# Altium schematic sheet 01_Measure.SchDoc
size A4
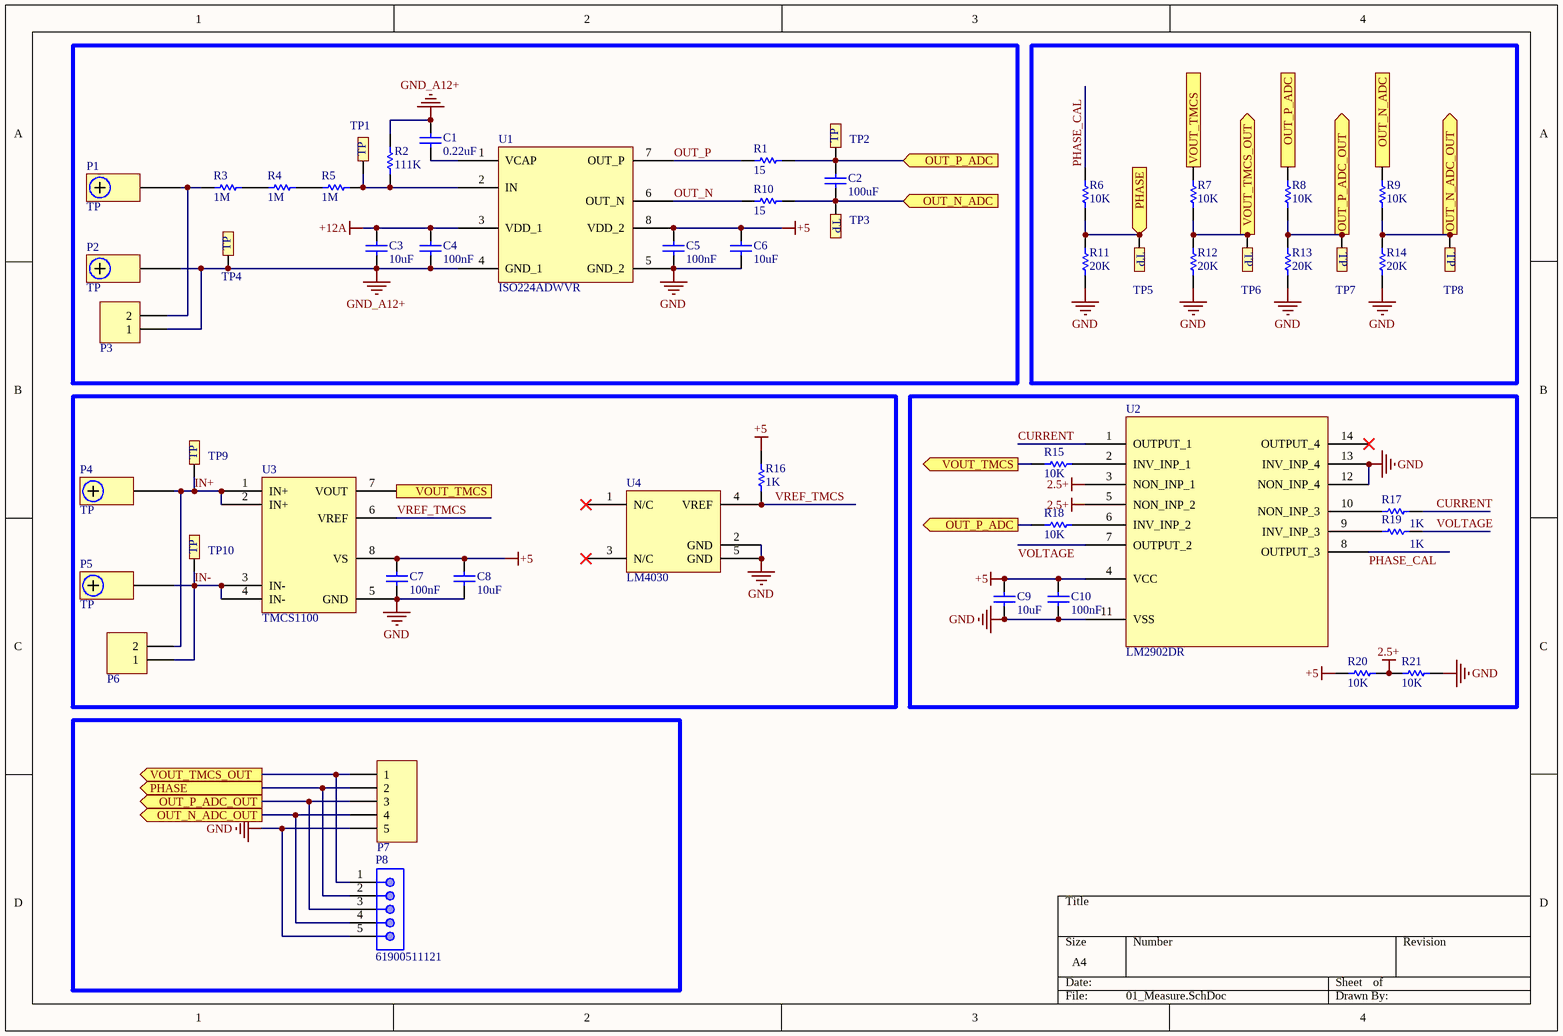
[diagram p0: 01_Measure.SchDoc]

## Parts
C1  value 0.22uF  [CAP-SM-0805]  (hidden comment: Cap Non-Pol SMD)
C2  value 100uF  [CAP-SM-1210]  (hidden comment: Cap Non-Pol SMD)
C3  value 10uF  [CAP-SM-0805]  (hidden comment: Cap Non-Pol SMD)
C4  value 100nF  [CAP-SM-0805]  (hidden comment: Cap Non-Pol SMD)
C5  value 100nF  [CAP-SM-0805]  (hidden comment: Cap Non-Pol SMD)
C6  value 10uF  [CAP-SM-0805]  (hidden comment: Cap Non-Pol SMD)
C7  value 100nF  [CAP-SM-0805]  (hidden comment: Cap Non-Pol SMD)
C8  value 10uF  [CAP-SM-0805]  (hidden comment: Cap Non-Pol SMD)
C9  value 10uF  [CAP-SM-0603]  (hidden comment: Cap Non-Pol SMD)
C10  value 100nF  [CAP-SM-0603]  (hidden comment: Cap Non-Pol SMD)
P1  TP  [TP]
P2  TP  [TP]
P3  Domino 2  [DOMINO 2- 5mm]  (value not drawn)
P4  TP  [TP]
P5  TP  [TP]
P6  Domino 2  [DOMINO 2- 5mm]  (value not drawn)
P7  Header 5  [JP5]  (value not drawn)
P8  61900511121  [61900511121]
R1  value 15  [RES-SM-1206]  (hidden comment: RESISTOR SMD)
R2  value 111K  [RES-SM-1206]  (hidden comment: RESISTOR SMD)
R3  value 1M  [RES-SM-1206]  (hidden comment: RESISTOR SMD)
R4  value 1M  [RES-SM-1206]  (hidden comment: RESISTOR SMD)
R5  value 1M  [RES-SM-1206]  (hidden comment: RESISTOR SMD)
R6  value 10K  [RES-SM-0603]  (hidden comment: RESISTOR SMD)
R7  value 10K  [RES-SM-0603]  (hidden comment: RESISTOR SMD)
R8  value 10K  [RES-SM-0603]  (hidden comment: RESISTOR SMD)
R9  value 10K  [RES-SM-0603]  (hidden comment: RESISTOR SMD)
R10  value 15  [RES-SM-1206]  (hidden comment: RESISTOR SMD)
R11  value 20K  [RES-SM-0603]  (hidden comment: RESISTOR SMD)
R12  value 20K  [RES-SM-0603]  (hidden comment: RESISTOR SMD)
R13  value 20K  [RES-SM-0603]  (hidden comment: RESISTOR SMD)
R14  value 20K  [RES-SM-0603]  (hidden comment: RESISTOR SMD)
R15  value 10K  [RES-SM-0603]  (hidden comment: RESISTOR SMD)
R16  value 1K  [RES-SM-0603]  (hidden comment: RESISTOR SMD)
R17  value 1K  [RES-SM-0603]  (hidden comment: RESISTOR SMD)
R18  value 10K  [RES-SM-0603]  (hidden comment: RESISTOR SMD)
R19  value 1K  [RES-SM-0603]  (hidden comment: RESISTOR SMD)
R20  value 10K  [RES-SM-0603]  (hidden comment: RESISTOR SMD)
R21  value 10K  [RES-SM-0603]  (hidden comment: RESISTOR SMD)
TP1  Test Point  [TP]  (value not drawn)
TP2  Test Point  [TP]  (value not drawn)
TP3  Test Point  [TP]  (value not drawn)
TP4  Test Point  [TP]  (value not drawn)
TP5  Test Point  [TP]  (value not drawn)
TP6  Test Point  [TP]  (value not drawn)
TP7  Test Point  [TP]  (value not drawn)
TP8  Test Point  [TP]  (value not drawn)
TP9  Test Point  [TP]  (value not drawn)
TP10  Test Point  [TP]  (value not drawn)
U1  ISO224ADWVR  [SOIC127P1150X280-8N]
U2  LM2902DR  [SOIC127P600X175-14N]
U3  TMCS1100  [SOIC127P650X175-8N]
U4  LM4030  [SOT95P279X130-5N]

## Ports
OUT_N_ADC (in), OUT_N_ADC (out), OUT_N_ADC_OUT (out), OUT_P_ADC (in), OUT_P_ADC (out), OUT_P_ADC_OUT (out), PHASE (in), PHASE (out), VOUT_TMCS (in), VOUT_TMCS (out), VOUT_TMCS_OUT (out)

## Nets
2.5+: R20.1 R21.2 U2.3(NON_INP_1) U2.5(NON_INP_2)
+5: C5.2 C6.2 C7.2 C8.2 C9.2 C10.1 R16.2 R20.2 U1.8(VDD_2) U2.4(VCC) U3.8(VS)
+12A: C3.2 C4.2 U1.3(VDD_1)
GND: C5.1 C6.1 C7.1 C8.1 C9.1 C10.2 P7.5 P8.5 R11.1 R12.1 R13.1 R14.1 R21.1 U1.5(GND_2) U2.11(VSS) U2.12(NON_INP_4) U2.13(INV_INP_4) U3.5(GND) U4.2(GND) U4.5(GND)
GND_A12+: C1.2 C3.1 C4.1 P2.1 P3.1 R2.2 TP4.TP1 U1.4(GND_1)
CURRENT: R17.1 U2.1(OUTPUT_1)
IN+: P4.1 P6.2 TP9.TP1 U3.1(IN+) U3.2(IN+)
IN-: P5.1 P6.1 TP10.TP1 U3.3(IN-) U3.4(IN-)
OUT_N: R10.1 U1.6(OUT_N)
OUT_N_ADC: C2.1 R9.2 R10.2 TP3.TP1 ; port OUT_N_ADC
OUT_N_ADC_OUT: P7.4 P8.4 R9.1 R14.2 TP8.TP1 ; port OUT_N_ADC_OUT
OUT_P: R1.1 U1.7(OUT_P)
OUT_P_ADC: C2.2 R1.2 R8.2 R18.2 TP2.TP1 ; port OUT_P_ADC
OUT_P_ADC_OUT: P7.3 P8.3 R8.1 R13.2 TP7.TP1 ; port OUT_P_ADC_OUT
PHASE: P7.2 P8.2 R6.1 R11.2 TP5.TP1 ; port PHASE
PHASE_CAL: R6.2 U2.8(OUTPUT_3)
VOLTAGE: R19.1 U2.7(OUTPUT_2)
VOUT_TMCS: R7.2 R15.1 U3.7(VOUT) ; port VOUT_TMCS
VOUT_TMCS_OUT: P7.1 P8.1 R7.1 R12.2 TP6.TP1 ; port VOUT_TMCS_OUT
VREF_TMCS: R16.1 U3.6(VREF) U4.4(VREF)
NetC1_1: C1.1 U1.1(VCAP)
NetP1_1: P1.1 P3.2 R3.1
NetR2_1: R2.1 R5.2 TP1.TP1 U1.2(IN)
NetR3_2: R3.2 R4.1
NetR4_2: R4.2 R5.1
NetR15_2: R15.2 U2.2(INV_INP_1)
NetR17_2: R17.2 U2.10(NON_INP_3)
NetR18_1: R18.1 U2.6(INV_INP_2)
NetR19_2: R19.2 U2.9(INV_INP_3)

Not connected (* = marked no-connect by the designer): U2 14(OUTPUT_4)*; U4 1(N/C)* 3(N/C)*

## Notes on the sheet
- (in symbol Test Point) TP

## Library data of the parts
C1-C10 = Cap Non-Pol SMD: Capacitor
P3 P6 = Domino 2: Domino, 2-Pin; LatestRevisionDate: 17-Jul-2002; LatestRevisionNote: Re-released for DXP Platform.; Publisher: Altium Limited
P7 = Header 5: Header, 5-Pin; LatestRevisionDate: 17-Jul-2002; LatestRevisionNote: Re-released for DXP Platform.; Publisher: Altium Limited
P8 = 61900511121: WR-WTB THT Male Vertical Locking Header, pitch 2.54mm, 5p; Pin Number: 5; Contact Resistance: 20mOhm; Rated Current: 3A; Withstanding Voltage: 1000VAC; Working Voltage: 250VAC; ComponentLink1Description: Manufacturer; ComponentLink1URL: http://www.we-online.de; ComponentLink2Description: Datasheet; ComponentLink2URL: https://www.we-online.com/catalog/datasheet/61900511121.pdf; Pitch: 2.54mm; Published Date: January 2020; Publisher: Wurth Elektronik; Mounting Technology: THT; Packaging: Bag; Operating Temperature: -40 to +105degC; Part Number: 61900511121; Gender: Male; Type: Vertical
R1-R21 = RESISTOR SMD: Resistor
U1 = ISO224ADWVR: Manufacturer: Texas Instruments; ComponentLink1Description: Supplier 1 Link; Supplier 1: Mouser; ComponentLink1URL: https://www.mouser.vn/ProductDetail/Texas-Instruments/ISO224ADWV?qs=%252BEew9%252B0nqrAIOtaYYgHDyw%3D%3D; Manufacturer P/N: ISO224ADWV; Supplier 1 P/N: 595-ISO224ADWV
U3 = TMCS1100: Manufacturer: Texas Instruments; Manufacturer P/N: TMCS1100A1QD; ComponentLink1Description: Supplier 1 Link; Supplier 1: Mouser; ComponentLink1URL: https://www.mouser.vn/ProductDetail/Texas-Instruments/TMCS1100A1QDR?qs=sPbYRqrBIVm7HRwTfsNKdw%3D%3D; Supplier 1 P/N: 595-TMCS1100A1QDR
U4 = LM4030: Manufacturer: Texas Instruments; Manufacturer P/N: LM4030BMF-2.5/NOPB; ComponentLink1Description: Supplier 1 Link; ComponentLink1URL: https://www.mouser.vn/ProductDetail/Texas-Instruments/LM4030BMF-25-NOPB?qs=QbsRYf82W3GjKEoF5S%2FJEg%3D%3D; Supplier 1: Mouser; Supplier 1 P/N: 926-LM4030BMF25NOPB
P1 P2 P4 P5 = TP: ComponentLink1Description: Supplier 1 Link